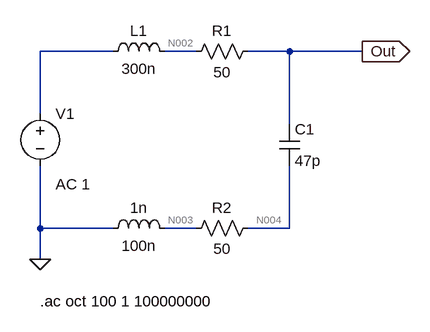
[diagram p0: schematic ADC.asc]
ADC.asc, the LTspice schematic file:
Version 4
SHEET 1 944 680
WIRE 0 -16 -112 -16
WIRE 128 -16 80 -16
WIRE 272 -16 208 -16
WIRE 384 -16 272 -16
WIRE -112 80 -112 -16
WIRE 272 96 272 -16
WIRE -112 256 -112 160
WIRE 0 256 -112 256
WIRE 128 256 80 256
WIRE 272 256 272 160
WIRE 272 256 208 256
WIRE -112 304 -112 256
FLAG 384 -16 Out
IOPIN 384 -16 Out
FLAG -112 304 0
SYMBOL ind -16 0 R270
WINDOW 0 32 56 VTop 2
WINDOW 3 5 56 VBottom 2
SYMATTR InstName L1
SYMATTR Value 300n
SYMBOL cap 256 96 R0
SYMATTR InstName C1
SYMATTR Value 47p
SYMBOL ind -16 272 R270
WINDOW 0 32 56 VTop 2
WINDOW 3 5 56 VBottom 2
SYMATTR InstName 1n
SYMATTR Value 100n
SYMBOL voltage -112 64 R0
WINDOW 123 24 124 Left 2
WINDOW 39 0 0 Left 0
SYMATTR Value2 AC 1
SYMATTR InstName V1
SYMATTR Value ""
SYMBOL res 224 -32 R90
WINDOW 0 0 56 VBottom 2
WINDOW 3 32 56 VTop 2
SYMATTR InstName R1
SYMATTR Value 50
SYMBOL res 224 240 R90
WINDOW 0 0 56 VBottom 2
WINDOW 3 32 56 VTop 2
SYMATTR InstName R2
SYMATTR Value 50
TEXT -112 368 Left 2 !.ac oct 100 1 100000000

The netlist it stands for:
* ADC.asc
L1 N001 N002 300n
C1 Out N004 47p
L§1n 0 N003 100n
V1 N001 0 AC 1
R1 Out N002 50
R2 N004 N003 50
.ac oct 100 1 100000000
.backanno
.end

* Results of the author's LTspice run, read from the files saved beside the schematic
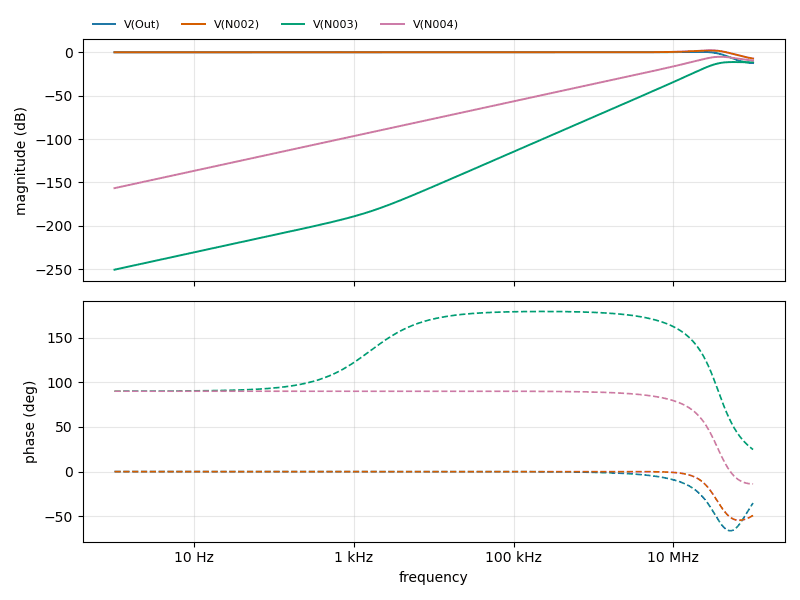
[diagram p1: AC Analysis of ADC.asc, plotted from the saved traces]
* AC Analysis, 1 run:
*   V(Out): 0.00 dB at 1 Hz, -12.34 dB at 100 MHz, peak 0.50 dB at 21.38 MHz, 3 dB below the peak at 40.71 MHz
*   V(N002): 0.00 dB at 1 Hz, -7.23 dB at 100 MHz, peak 2.18 dB at 29.41 MHz, 3 dB below the peak at 50.54 MHz
*   V(N003): -250.59 dB at 1 Hz, -11.62 dB at 100 MHz, peak -11.23 dB at 57.22 MHz, 3 dB below the peak at 31.91 MHz
*   V(N004): -156.61 dB at 1 Hz, -9.49 dB at 100 MHz, peak -5.14 dB at 38.81 MHz, 3 dB below the peak at 23.18 MHz and 75.56 MHz